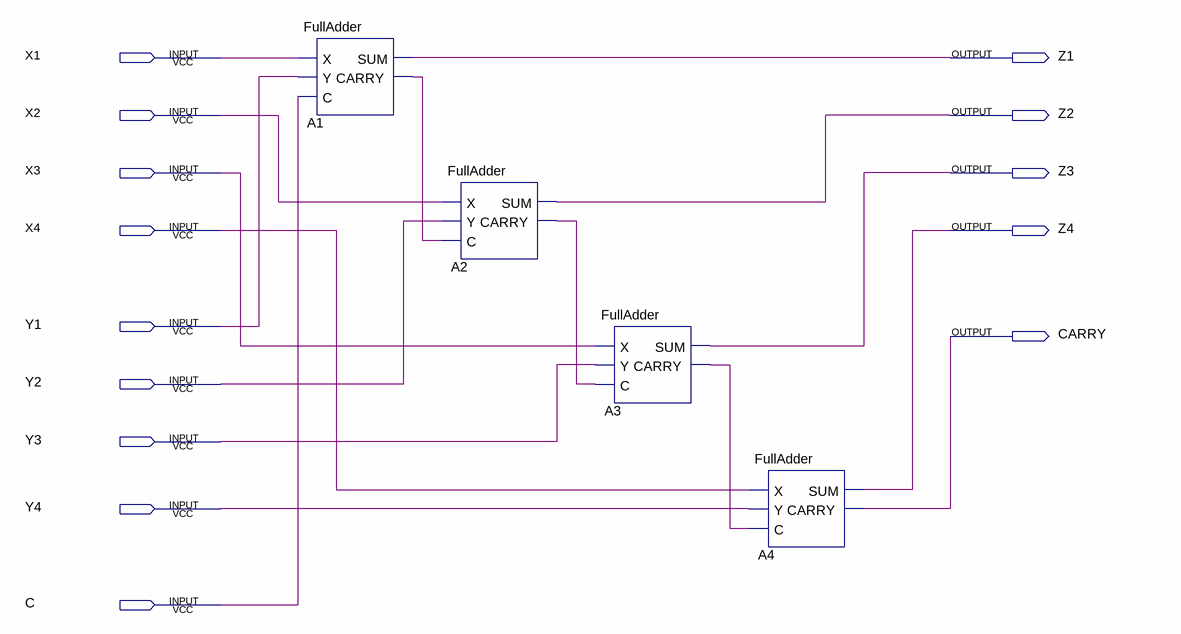
[diagram p0: schematic sheet]
// Quartus schematic 4bitAdder.bdf as structural Verilog: 4 symbols, 14 pins
module \4bitAdder  (
  input  X1,
  input  X2,
  input  X3,
  input  X4,
  input  Y1,
  input  Y2,
  input  Y3,
  input  Y4,
  input  C,
  output Z1,
  output Z2,
  output Z3,
  output Z4,
  output CARRY
);

  wire A1_carry, A2_carry, A3_carry;

  FullAdder A1 (.X(X1), .Y(Y1), .C(C), .SUM(Z1), .CARRY(A1_carry));
  FullAdder A2 (.X(X2), .Y(Y2), .C(A1_carry), .SUM(Z2), .CARRY(A2_carry));
  FullAdder A3 (.X(X3), .Y(Y3), .C(A2_carry), .SUM(Z3), .CARRY(A3_carry));
  FullAdder A4 (.X(X4), .Y(Y4), .C(A3_carry), .SUM(Z4), .CARRY(CARRY));
endmodule
